# EAGLE design Display (EAGLE 8.6.2)
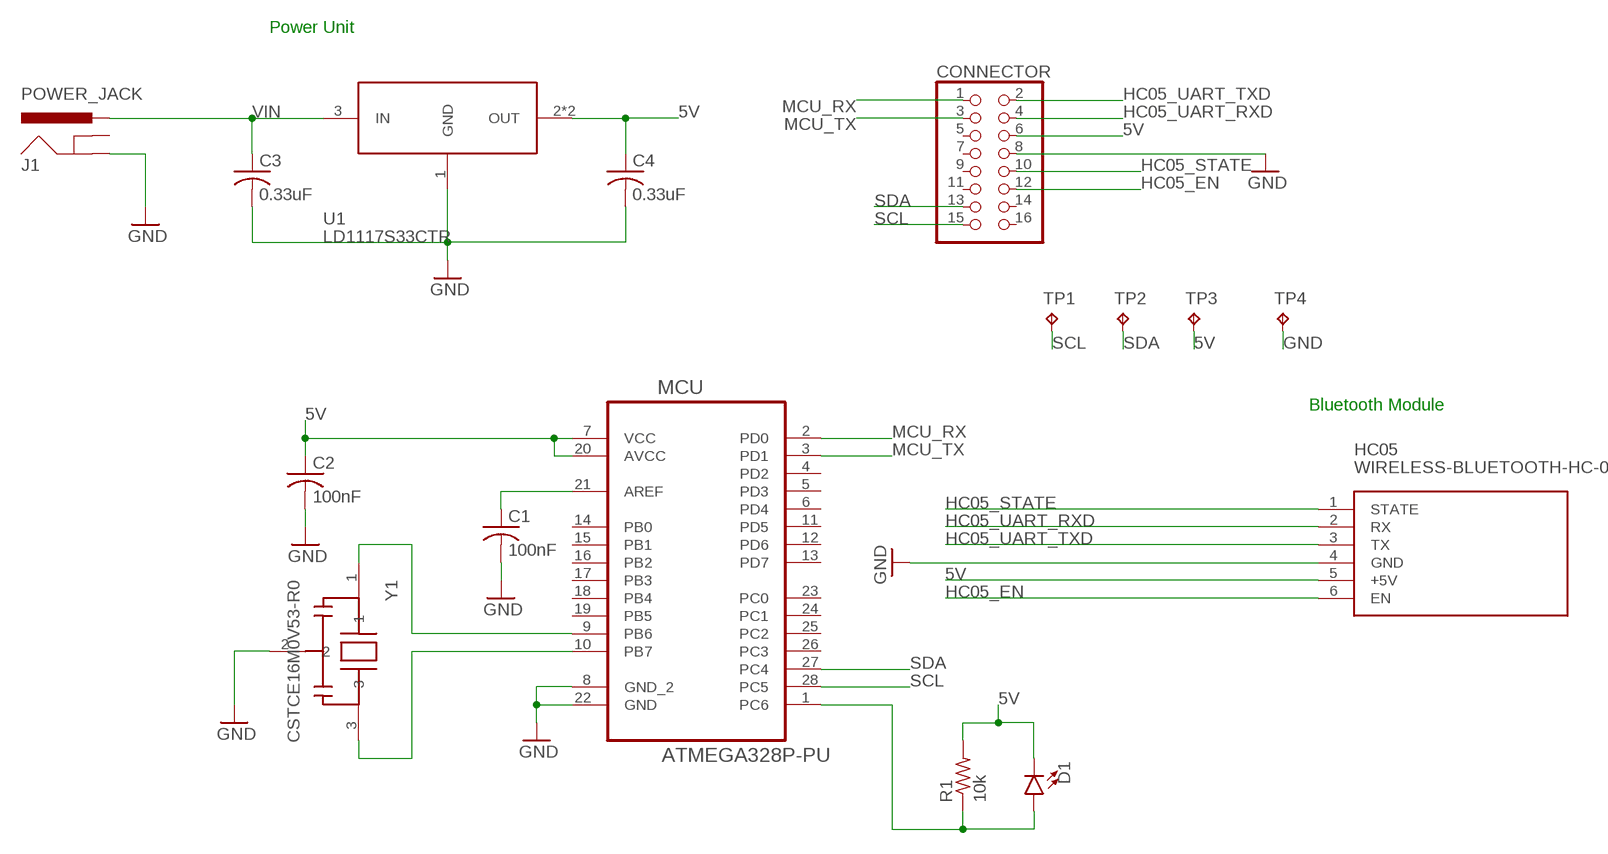
[diagram p0: schematic, sheet 1]

## Parts
C1  100nF  C-USC0603  [C0603]
C2  100nF  C-USC0603  [C0603]
C3  0.33uF  C-USC0603  [C0603]
C4  0.33uF  C-USC0603  [C0603]
CONNECTOR  PINHD-2X8  [2X08]
D1  LED1206  [LED-1206]
HC05  WIRELESS-BLUETOOTH-HC-05  [WIRELESS-BLUETOOTH-HC-05]
J1  POWER_JACK  [POWER_JACK_PTH]
MCU  ATMEGA328P-PU  [DIP254P762X457-28]
R1  10k  R-US_R0603  [R0603]
TP1  TPTP20R  [TP20R]
TP2  TPTP20R  [TP20R]
TP3  TPTP20R  [TP20R]
TP4  TPTP20R  [TP20R]
U1  LD1117S33CTR  [SOT223]
Y1  CSTCE16M0V53-R0  [OSC_CSTCE16M0V53-R0]

## Nets
5V [5V]: C2.1 C4.1 CONNECTOR.6 D1.C HC05.5(+5V) MCU.7(VCC) MCU.20(AVCC) R1.2 TP3.TP U1.2(OUT) U1.4(OUT)
GND [ground]: C1.2 C2.2 C3.2 C4.2 CONNECTOR.8 HC05.4(GND) J1.GND MCU.8(GND_2) MCU.22(GND) TP4.TP U1.1(GND) Y1.2
HC05_EN: CONNECTOR.12 HC05.6(EN)
HC05_STATE: CONNECTOR.10 HC05.1(STATE)
HC05_UART_RXD: CONNECTOR.4 HC05.2(RX)
HC05_UART_TXD: CONNECTOR.2 HC05.3(TX)
MCU_RX: CONNECTOR.1 MCU.2(PD0)
MCU_TX: CONNECTOR.3 MCU.3(PD1)
N$1: MCU.9(PB6) Y1.1
N$2: C1.1 MCU.21(AREF)
N$3: MCU.10(PB7) Y1.3
N$4: D1.A MCU.1(PC6) R1.1
SCL: CONNECTOR.15 MCU.28(PC5) TP1.TP
SDA: CONNECTOR.13 MCU.27(PC4) TP2.TP
VIN: C3.1 J1.PWR U1.3(IN)
Unconnected: CONNECTOR.5 CONNECTOR.7 CONNECTOR.9 CONNECTOR.11 CONNECTOR.14 CONNECTOR.16 J1.GNDBREAK MCU.4(PD2) MCU.5(PD3) MCU.6(PD4) MCU.11(PD5) MCU.12(PD6) MCU.13(PD7) MCU.14(PB0) MCU.15(PB1) MCU.16(PB2) MCU.17(PB3) MCU.18(PB4) MCU.19(PB5) MCU.23(PC0) MCU.24(PC1) MCU.25(PC2) MCU.26(PC3)

## Notes on the sheet
- Power Unit
- Bluetooth Module

## Library data of the parts
C1-C4 = rcl:C-US: CAPACITOR, American symbol; SPICEPREFIX: C
CONNECTOR = pinhead:PINHD-2X8: PIN HEADER
D1 = SparkFun-LED:LED: LED (Generic) Standard schematic elements and footprints for 5mm, 3mm, 1206, and 0603 sized LEDs. Generic LEDs with no color specified.
HC05 = diy-modules:WIRELESS-BLUETOOTH-HC-05: Bluetooth Transceiver Module based on HC-05 board Tutorial is available here: https://arduino-info.wikispaces.com/BlueTooth-HC05-HC06-Modules-How-To Click here to find device on ebay.com <http://www.ebay.com/sch/hc-05+module+rs232>
J1 = SparkFun-Connectors:POWER_JACK: Power Jack Connector This is the standard 5.5mm barrel jack for power. The PTH is the most common, proven, reliable, footprint. The Slot footprint only works if the mill layer is transmitted to the PCB fab house so be warned. Here are the connectors we sell at SparkFun: DC Barrel Power Jack/Connector <https://www.sparkfun.com/products/119> (PRT-00119) DC Barrel Power Jack/Connector (SMD) <https://www.sparkfun.com/products/12748> (PRT-12748) DC Barrel Jack Adapter - Breadboard Compatible <https://www.sparkfun.com/products/10811> (PRT-10811) It is used on this SparkFun product (and many, many others): SparkFun RedBoard - Programmed with Arduino <https://www.sparkfun.com/products/12757> (DEV-12757) Also, if you need a mating power supply or connector, please check these out: Wall Adapter Power Supply - 9VDC 650mA <https://www.sparkfun.com/products/298> (TOL-00298) DC Barrel Jack Adapter - Male <https://www.sparkfun.com/products/10287> (PRT-10287); PROD_ID: CONN-08197
MCU = Atmel_By_element14_Batch_1-00:ATMEGA328P-PU: 8-bit Microcontroller with In-System Programmable Flash; MPN: ATMEGA328P-PU; OC_FARNELL: 1715487; OC_NEWARK: 15R0268; PACKAGE: PDIP-28; SUPPLIER: Atmel
R1 = rcl:R-US_: RESISTOR, American symbol; SPICEPREFIX: R
TP1-TP4 = testpad:TP: Test pad
U1 = LD1117S33CTR:LD1117S33CTR: http://octopart.com/ld1117s33tr-stmicroelectronics-526708; AVAILABILITY: Good; DESCRIPTION: LD1117 Series 1300 mA 3.3 V Fixed Output Positive Voltage LDO Regulator- SOT-223; MF: STMicroelectronics; MP: LD1117S33CTR; PACKAGE: SOT-223 STMicroelectronics; PRICE: 0.19 USD
Y1 = CSTCE16M0V53-R0:CSTCE16M0V53-R0: Ceramic Resonator 16MHz ±0.5% (Tol) ±0.3% (Stability) 15pF 40Ohm 3-Pin CSMD T/R; AVAILABILITY: Good; DESCRIPTION: Ceramic Resonator 16MHz ??0.5% (Tol) ??0.3% (Stability) 15pF 40Ohm 3-Pin CSMD T/R; MF: Murata; MP: CSTCE16M0V53-R0; PACKAGE: SMD-3 Murata; PRICE: 0.29 USD

## Net classes
0 default: width 0.33 mm, drill 0.559 mm, clearance 0.254 mm
1 ground: width 0.381 mm, drill 0.254 mm, clearance 0.254 mm
2 5V: width 0.381 mm, drill 0.254 mm, clearance 0.254 mm

## Board
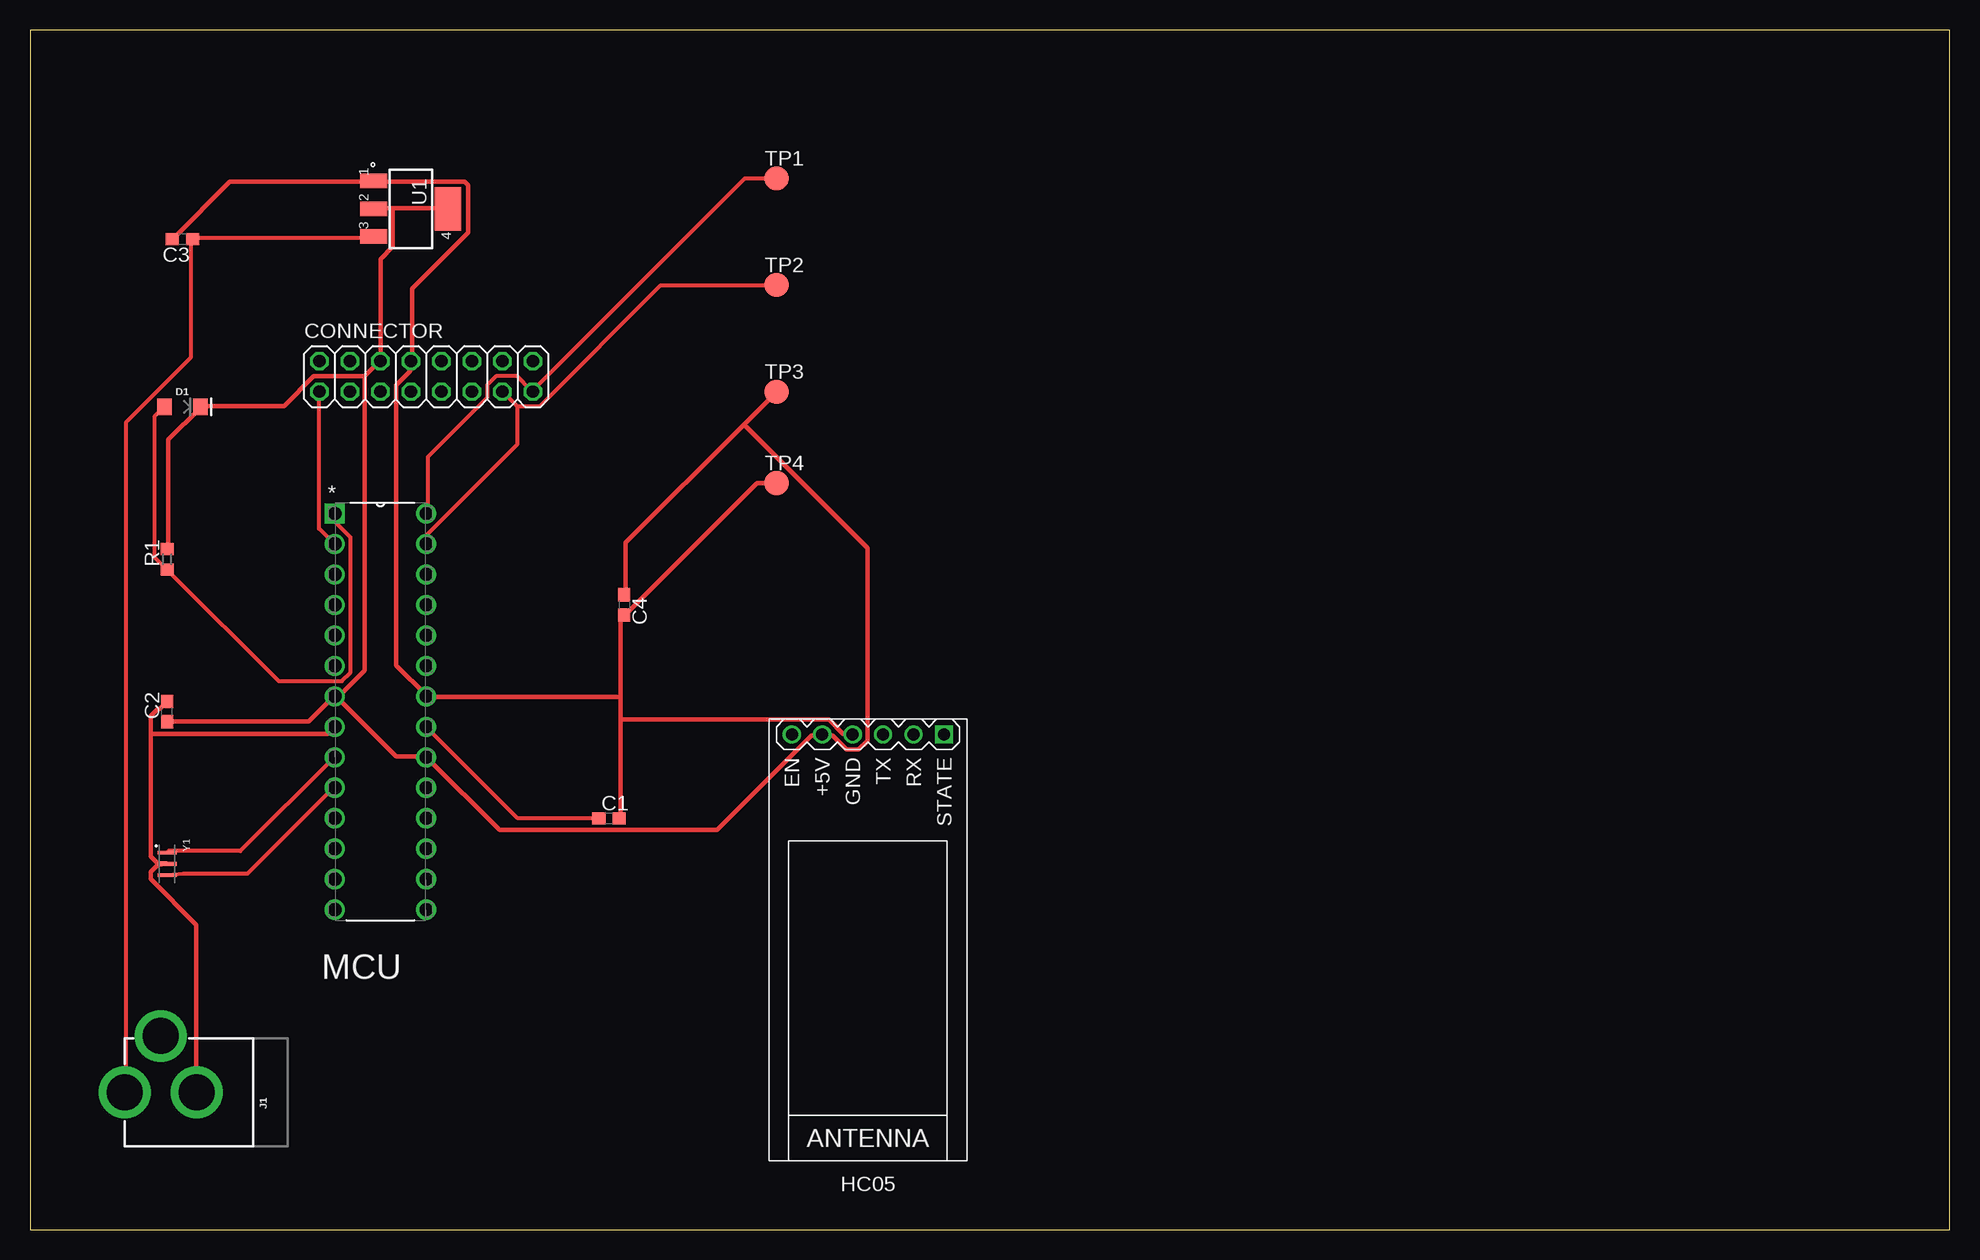
[diagram p1: board, top side]
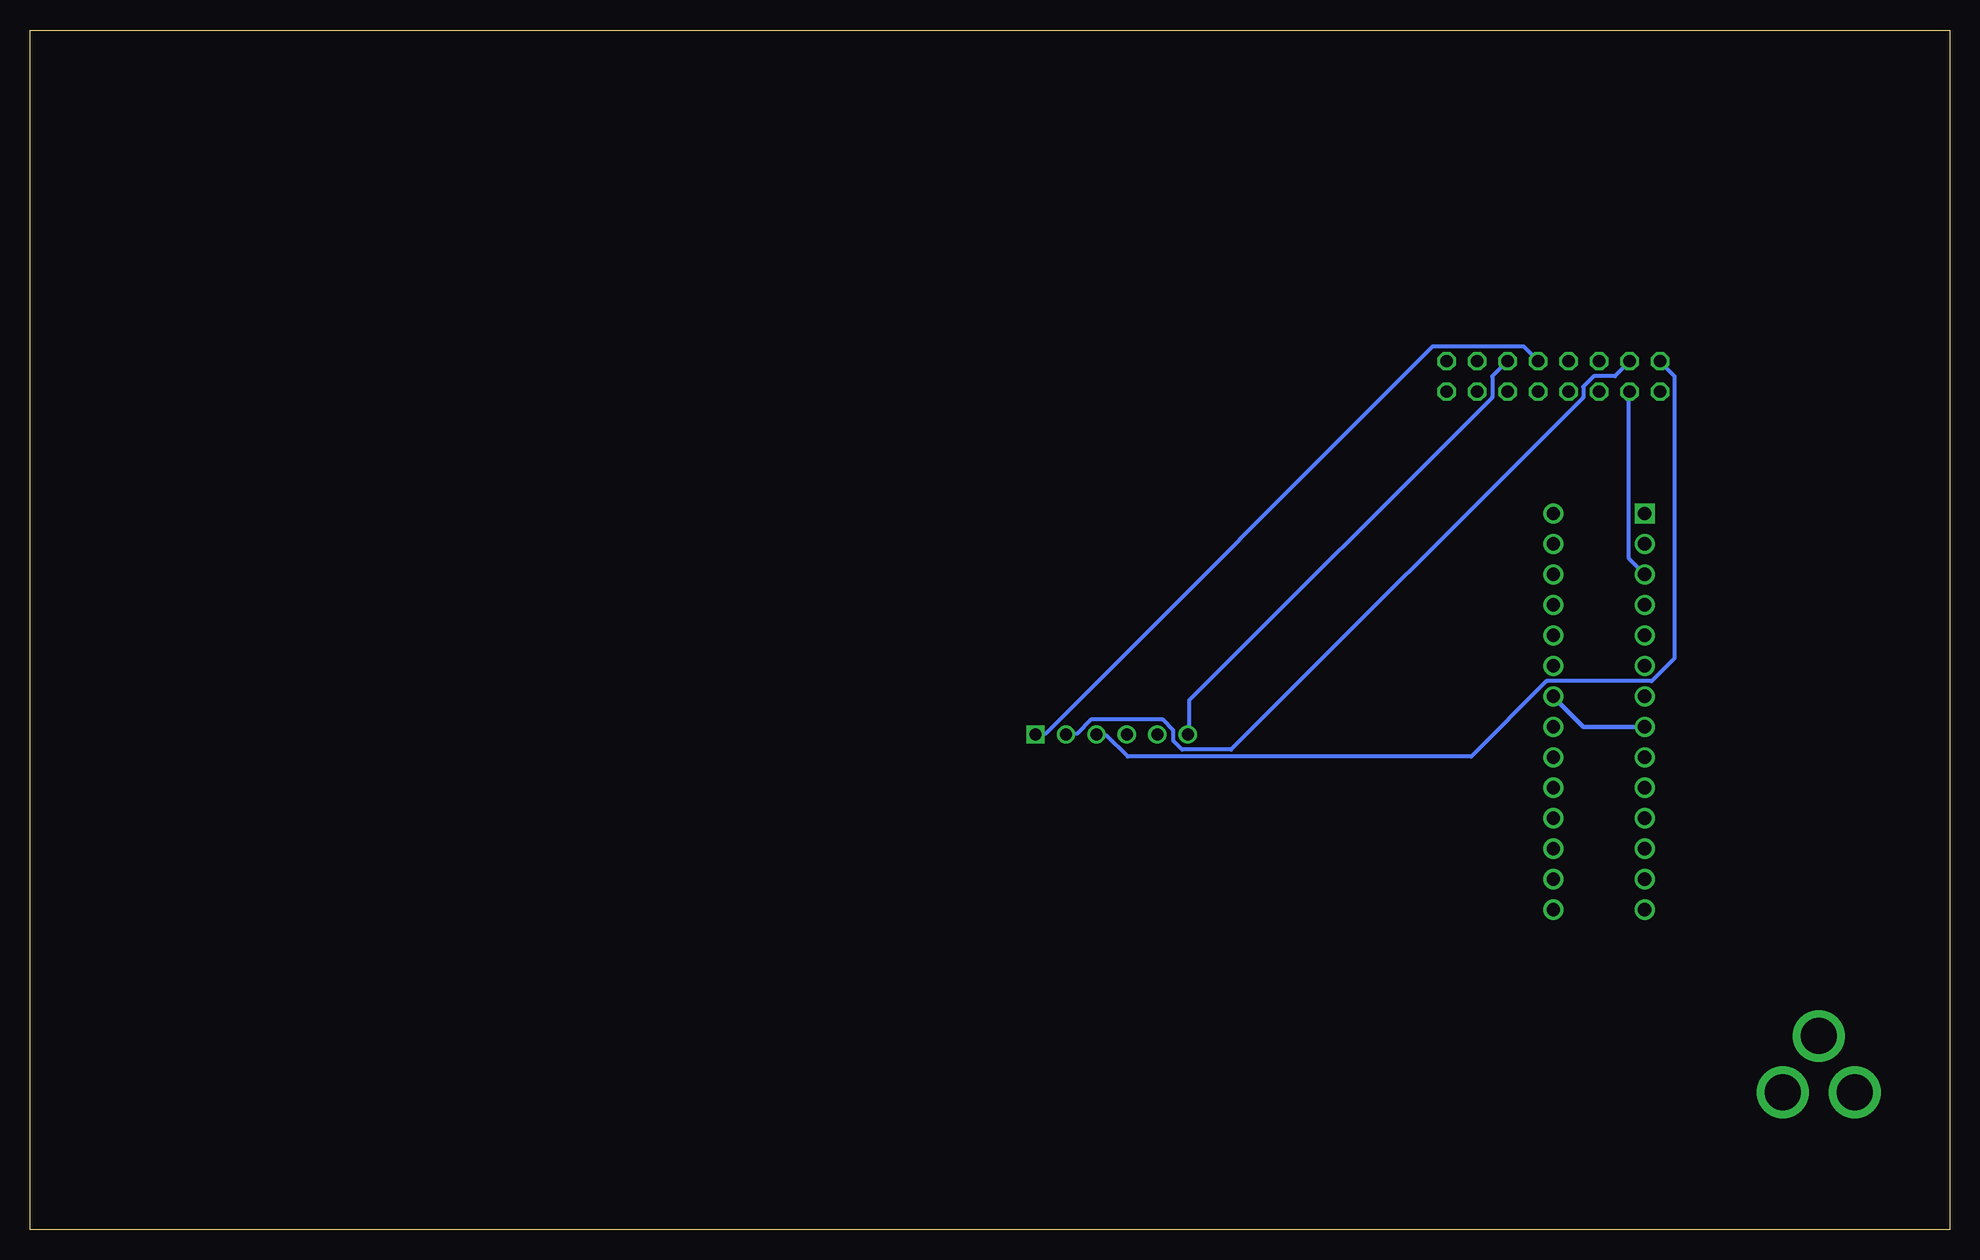
[diagram p2: board, bottom side, seen from below]

Size 160 x 100 mm. Coordinates in mm from the lower left corner, seen from the top.
Outline: 0,0 160,0 160,100 0,100 0,0
Copper layers (1*16): Top 0.035mm / dielectric 1.5mm / Bottom 0.035mm
Design rules "MWSEagleDesignRules3": minimum track width 13mil, minimum drill 22mil, track to track 8.5mil, track to pad 8.5mil, pad to pad 8.5mil, via to via 8.5mil, smd to smd 8mil, copper to edge 40mil, drill to drill 8mil, minimum pad ring 10mil, minimum via ring 8mil, stop-mask expansion 4mil, vias tented up to drill 0mil, thermal gap 10mil

### Footprints (pad centres in the part's own frame; a part is rotated, then mirrored left to right if it is on the bottom)
C0603 = smd 1.1 x 1: 1 -0.85,0; 2 0.85,0
2X08 = drill 1.016 octagon: 1 -8.89,-1.27; 2 -8.89,1.27; 3 -6.35,-1.27; 4 -6.35,1.27; 5 -3.81,-1.27; 6 -3.81,1.27; 7 -1.27,-1.27; 8 -1.27,1.27; 9 1.27,-1.27; 10 1.27,1.27; 11 3.81,-1.27; 12 3.81,1.27; 13 6.35,-1.27; 14 6.35,1.27; 15 8.89,-1.27; 16 8.89,1.27
LED-1206 = smd 1.2 x 1.4: A -1.5,0; C 1.5,0
WIRELESS-BLUETOOTH-HC-05 = drill 1 square: 1 -6.35,-17.145 | drill 1: 2 -3.81,-17.145; 3 -1.27,-17.145; 4 1.27,-17.145; 5 3.81,-17.145; 6 6.35,-17.145
POWER_JACK_PTH = drill 2.997 pad 4.318: GND 0,7.7; GNDBREAK 4.7,10.7; PWR 0,13.7
DIP254P762X457-28 = drill 1.118 square: 1 -7.62,33.02 | drill 1.118: 2 -7.62,30.48; 3 -7.62,27.94; 4 -7.62,25.4; 5 -7.62,22.86; 6 -7.62,20.32; 7 -7.62,17.78; 8 -7.62,15.24; 9 -7.62,12.7; 10 -7.62,10.16; 11 -7.62,7.62; 12 -7.62,5.08; 13 -7.62,2.54; 14 -7.62,0; 15 0,0; 16 0,2.54; 17 0,5.08; 18 0,7.62; 19 0,10.16; 20 0,12.7; 21 0,15.24; 22 0,17.78; 23 0,20.32; 24 0,22.86; 25 0,25.4; 26 0,27.94; 27 0,30.48; 28 0,33.02
R0603 = smd 1 x 1.1: 1 -0.85,0; 2 0.85,0
TP20R = smd 2 x 2: TP 0,0
SOT223 = smd 2.235 x 1.219: 1 -3.099,2.311; 2 -3.099,0; 3 -3.099,-2.311 | smd 2.2 x 3.6: 4 3.099,0
OSC_CSTCE16M0V53-R0 = smd 0.3 x 1.6: 1 -0.95,0; 2 0,0; 3 0.95,0

### Placement (x,y rotation side)
C1  48.26,34.29 0 top
C2  11.43,43.18 90 top
C3  12.7,82.55 180 top
C4  49.53,52.07 270 top
CONNECTOR  33.02,71.12 0 top
D1  12.7,68.58 0 top
HC05  69.85,24.13 180 top
J1  21.59,11.43 90 top
MCU  33.02,26.67 0 top
R1  11.43,55.88 90 top
TP1  62.23,87.63 0 top
TP2  62.23,78.74 0 top
TP3  62.23,69.85 0 top
TP4  62.23,62.23 0 top
U1  31.75,85.09 0 top
Y1  11.43,30.48 270 top

### Tracks (layer width: path | path; a pad name or v marks a point on that pad's centre or on a via)
5V
  Top 0.381: 59.52,67.11 62.22,69.81 TP3.TP | 59.52,67.11 49.66,57.25 49.66,53.02 C4.1 | 59.52,67.11 69.81,56.81 69.81,40.75 69.08,40.02 68.06,40.02 66.89,41.19 66.16,41.19 HC05.5 65.87,41.19 65.14,41.19 57.25,33.3 39.14,33.3 33.15,39.29 MCU.20 33.01,39.43 30.52,39.43 25.56,44.4 MCU.7 | C2.1 11.54,42.35 23.22,42.35 25.27,44.4 MCU.7 | R1.2 11.54,56.81 11.54,65.87 14.17,68.5 D1.C 14.31,68.64 21.18,68.64 23.66,71.13 27.9,71.13 | 30.23,85.15 34.76,85.15 U1.4 | 30.23,85.15 28.77,85.15 U1.2 | 30.23,85.15 30.23,81.93 29.21,80.91 CONNECTOR.6 29.06,72.3 27.9,71.13 | 27.9,71.13 27.9,46.59 25.7,44.4 MCU.7
GND
  Top 0.381: 49.22,44.4 49.22,50.83 49.51,51.12 C4.2 49.66,51.26 60.61,62.22 62.22,62.22 TP4.TP | 49.22,44.4 49.22,42.5 | 49.22,42.5 49.22,34.32 C1.2 | 49.22,42.5 66.6,42.5 67.77,41.33 68.5,41.33 HC05.4 | C3.2 11.98,82.66 16.65,87.34 28.63,87.34 U1.1 28.77,87.34 36.22,87.34 36.51,87.05 36.51,83.1 31.84,78.43 31.84,72.44 CONNECTOR.8 31.69,72.3 31.69,71.56 30.52,70.4 30.52,47.03 33.01,44.55 MCU.22 33.15,44.4 49.22,44.4 | 10.08,41.33 10.08,31.11 10.66,30.52 11.39,30.52 Y1.2 10.66,30.38 10.08,29.79 10.08,29.21 13.88,25.41 13.88,11.54 J1.GND | 10.08,41.33 10.08,42.79 10.66,43.38 10.81,43.38 11.39,43.96 C2.2 | 10.08,41.33 24.83,41.33 25.27,41.77 MCU.8
  Bottom 0.381: MCU.8 25.41,41.92 30.52,41.92 33.01,44.4 MCU.22
HC05_EN
  Bottom 0.33: HC05.6 63.39,41.33 63.39,44.11 38.12,69.37 38.12,71.13 36.95,72.3 CONNECTOR.12
HC05_STATE
  Bottom 0.33: HC05.1 76.09,41.33 75.36,41.33 43.09,73.61 35.49,73.61 34.32,72.44 CONNECTOR.10
HC05_UART_RXD
  Bottom 0.33: HC05.2 73.61,41.33 72.73,41.33 71.56,42.5 65.58,42.5 64.7,41.62 64.7,40.75 63.97,40.02 59.88,40.02 30.52,69.37 30.52,70.25 29.65,71.13 27.9,71.13 26.73,72.3 CONNECTOR.4
HC05_UART_TXD
  Bottom 0.33: HC05.3 70.98,41.19 70.25,41.19 68.5,39.43 39.87,39.43 33.59,45.71 24.83,45.71 22.93,47.61 22.93,71.13 24.1,72.3 CONNECTOR.2
MCU_RX
  Top 0.33: CONNECTOR.1 24.1,69.81 24.1,58.42 25.27,57.25 MCU.2
MCU_TX
  Bottom 0.33: MCU.3 26.73,55.94 26.73,69.81 CONNECTOR.3
N$1
  Top 0.33: Y1.1 11.54,31.55 17.53,31.55 25.27,39.29 MCU.9
N$2
  Top 0.33: C1.1 47.32,34.32 40.6,34.32 33.15,41.77 MCU.21
N$3
  Top 0.33: Y1.3 12.81,29.65 18.11,29.65 25.27,36.8 MCU.10
N$4
  Top 0.33: D1.A 11.1,68.5 10.37,67.77 10.37,56.08 11.39,55.06 R1.1 11.54,54.91 20.74,45.71 26,45.71 26.73,46.44 26.73,57.69 25.41,59 25.41,59.59 MCU.1
SCL
  Top 0.33: TP1.TP 59.59,87.63 41.92,69.96 CONNECTOR.15 41.77,69.96 40.6,71.13 38.85,71.13 38.12,70.4 38.12,69.37 33.15,64.41 33.15,59.73 MCU.28
SDA
  Top 0.33: 40.6,68.64 42.5,68.64 52.58,78.72 62.22,78.72 TP2.TP | 40.6,68.64 39.43,69.81 CONNECTOR.13 | 40.6,68.64 40.6,65.43 33.15,57.98 33.15,57.25 MCU.27
VIN
  Top 0.33: U1.3 28.63,82.66 13.58,82.66 C3.1 13.44,82.52 13.44,72.73 8.03,67.33 8.03,11.54 J1.PWR